# Altium project PCB_Project.PrjPcb
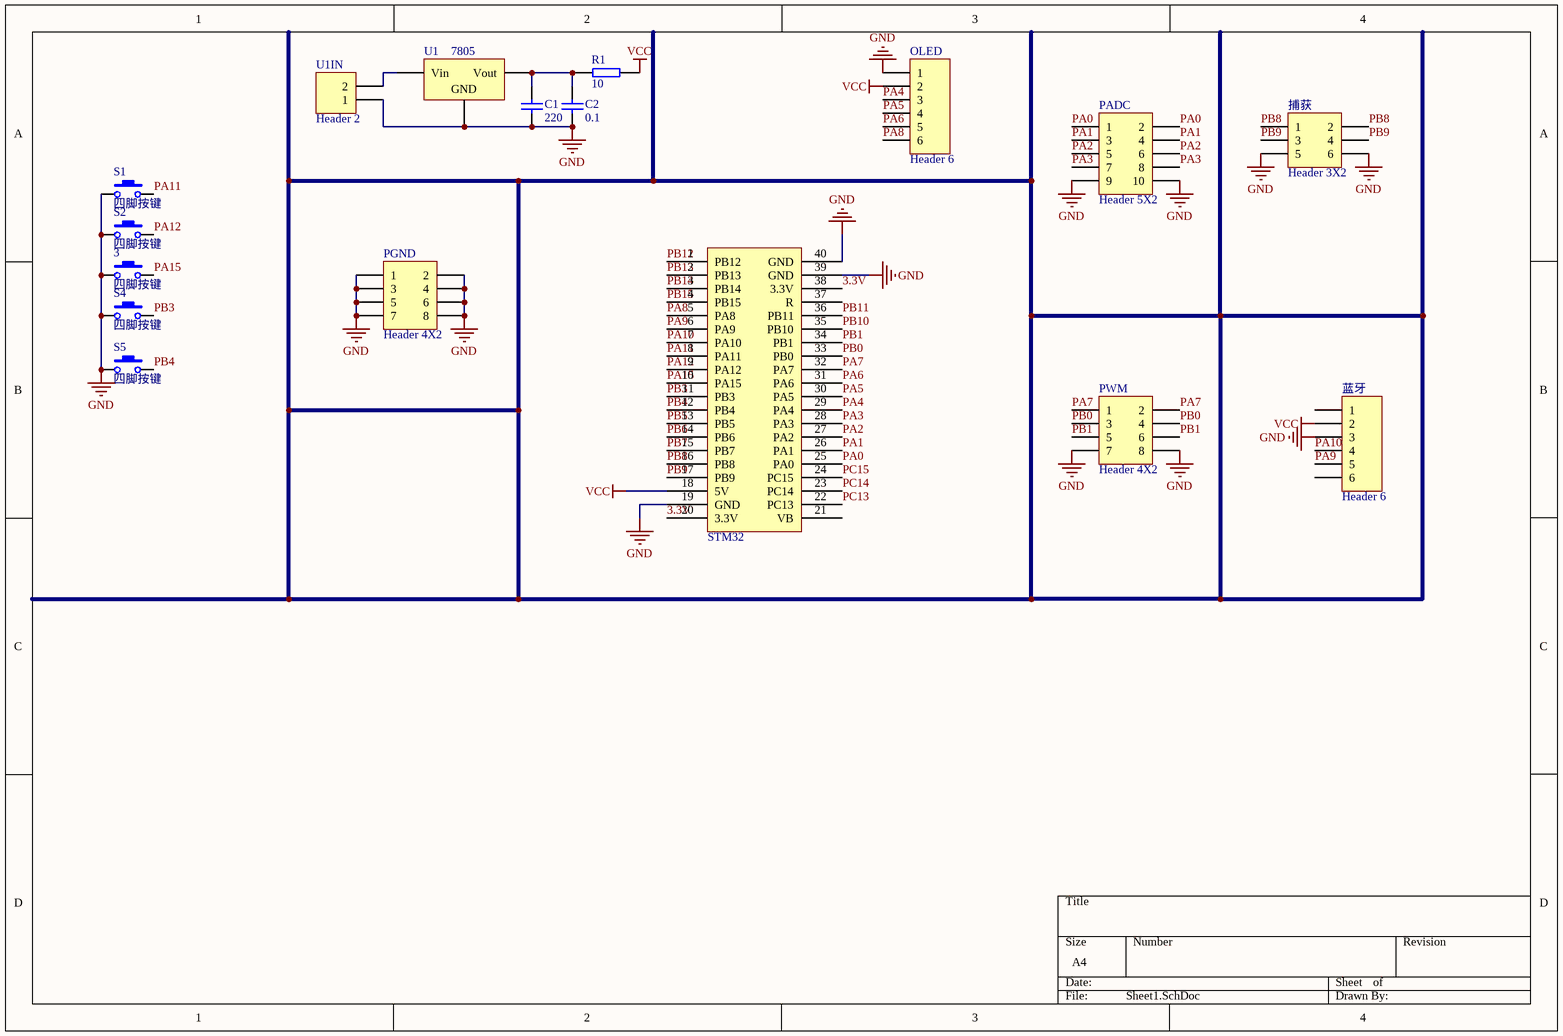
[diagram p0: Sheet1.SchDoc]
1 sheet, 17 parts. Net scope: global (net labels, ports and power ports of the same name join across sheets).
Board file: PCB1.PcbDoc

## Sheet Sheet1.SchDoc
size A4

### Parts
3  四脚按键  [四脚按键]
C1  220  [CAP]
C2  0.1  [CAP]
OLED  Header 6  [HDR1X6]
PADC  Header 5X2  [HDR2X5]
PGND  Header 4X2  [HDR2X4]
PWM  Header 4X2  [HDR2X4]
R1  10  [RES]
S1  四脚按键  [四脚按键]
S2  四脚按键  [四脚按键]
S4  四脚按键  [四脚按键]
S5  四脚按键  [四脚按键]
STM32  Component_1  [PCBComponent_1]  (value not drawn)
U1  7805  [SFM-T3/A4.7V]
U1IN  Header 2  [tie-in]
捕获  Header 3X2  [HDR2X3]
蓝牙  Header 6  [HDR1X6]

### Nets
GND: 3.1 C1.1 C2.1 OLED.1 PADC.9 PADC.10 PGND.1 PGND.2 PGND.3 PGND.4 PGND.5 PGND.6 PGND.7 PGND.8 PWM.7 PWM.8 S1.1 S2.1 S4.1 S5.1 STM32.19(GND) STM32.39(GND) STM32.40(GND) U1.2(GND) U1IN.1 捕获.5 捕获.6 蓝牙.3
VCC: OLED.2 R1.2 STM32.18(5V) 蓝牙.2
3.3V: STM32.20(3.3V) STM32.38(3.3V)
PA0: PADC.1 PADC.2 STM32.25(PA0)
PA1: PADC.3 PADC.4 STM32.26(PA1)
PA2: PADC.5 PADC.6 STM32.27(PA2)
PA3: PADC.7 PADC.8 STM32.28(PA3)
PA4: OLED.3 STM32.29(PA4)
PA5: OLED.4 STM32.30(PA5)
PA6: OLED.5 STM32.31(PA6)
PA7: PWM.1 PWM.2 STM32.32(PA7)
PA8: OLED.6 STM32.5(PA8)
PA9: STM32.6(PA9) 蓝牙.5
PA10: STM32.7(PA10) 蓝牙.4
PA11: S1.2 STM32.8(PA11)
PA12: S2.2 STM32.9(PA12)
PA15: 3.2 STM32.10(PA15)
PB0: PWM.3 PWM.4 STM32.33(PB0)
PB1: PWM.5 PWM.6 STM32.34(PB1)
PB3: S4.2 STM32.11(PB3)
PB4: S5.2 STM32.12(PB4)
PB5: STM32.13(PB5)
PB6: STM32.14(PB6)
PB7: STM32.15(PB7)
PB8: STM32.16(PB8) 捕获.1 捕获.2
PB9: STM32.17(PB9) 捕获.3 捕获.4
PB10: STM32.35(PB10)
PB11: STM32.36(PB11)
PB12: STM32.1(PB12)
PB13: STM32.2(PB13)
PB14: STM32.3(PB14)
PB15: STM32.4(PB15)
PC13: STM32.22(PC13)
PC14: STM32.23(PC14)
PC15: STM32.24(PC15)
NetC1_2: C1.2 C2.2 R1.1 U1.3(Vout)
NetU1_1: U1.1(Vin) U1IN.2

Not connected (* = marked no-connect by the designer): STM32 21(VB) 37(R); 蓝牙 1 6

### Library data of the parts
C1 C2 = CAP
OLED 蓝牙 = Header 6: Header, 6-Pin; LatestRevisionDate: 17-Jul-2002; LatestRevisionNote: Re-released for DXP Platform.; Publisher: Altium Limited
PADC = Header 5X2: Header, 5-Pin, Dual row; LatestRevisionDate: 17-Jul-2002; LatestRevisionNote: Re-released for DXP Platform.; Publisher: Altium Limited
PGND PWM = Header 4X2: Header, 4-Pin, Dual row; LatestRevisionDate: 17-Jul-2002; LatestRevisionNote: Re-released for DXP Platform.; Publisher: Altium Limited
R1 = res
U1 = 78稳压块
U1IN = Header 2: Header, 2-Pin; LatestRevisionDate: 17-Jul-2002; LatestRevisionNote: Re-released for DXP Platform.; Publisher: Altium Limited
捕获 = Header 3X2: Header, 3-Pin, Dual row; LatestRevisionDate: 17-Jul-2002; LatestRevisionNote: Re-released for DXP Platform.; Publisher: Altium Limited